# Altium schematic sheet Driver.SchDoc
size 279 x 215 mm; Engineer: Kyle Hong; Revision: 2; SheetNumber: 2; SheetTotal: 3
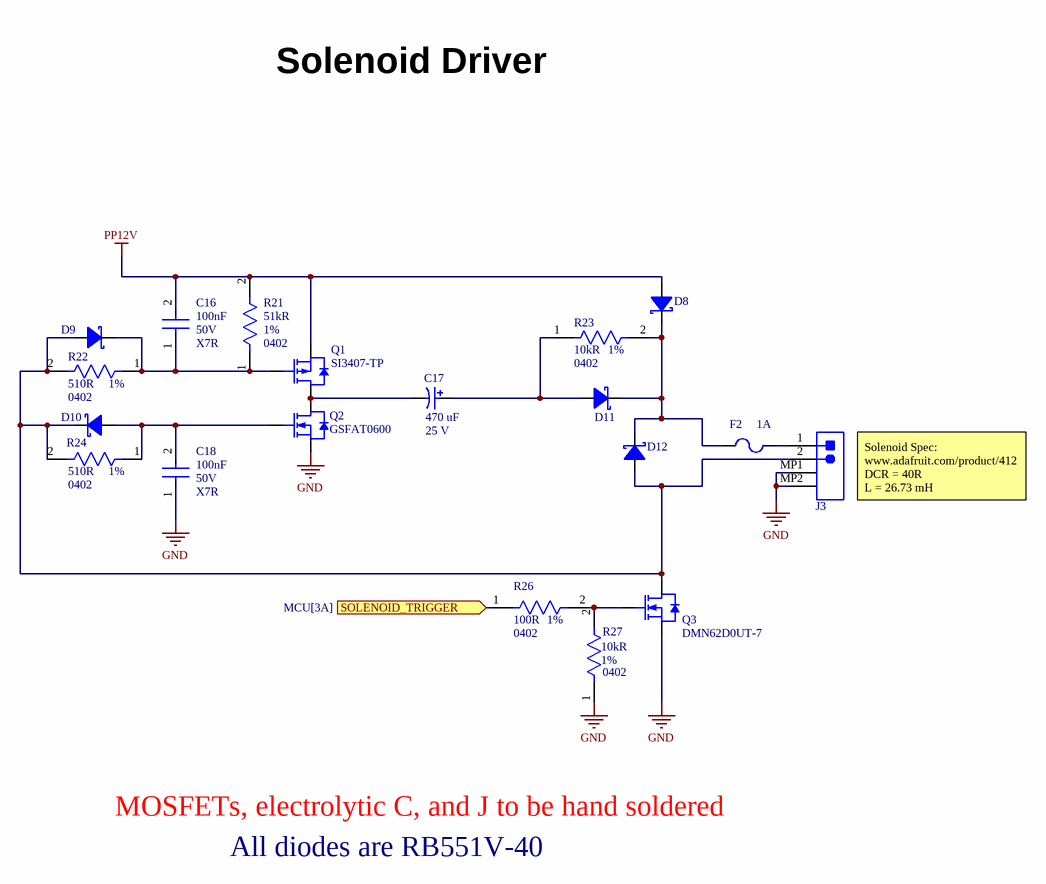
[diagram p0: Driver.SchDoc]

## Parts
C16  Dielectric: X7R  Voltage Rating: 50V  Capacitance: 100nF  [CAP0402]  (hidden comment: CL05B104KB54PNC)
C17  Rated Capacitance: 470 uF  Rated Voltage: 25 V  [NIC-CAPA2-10X10_V]  (hidden comment: UUD1E471MNL1GS)
C18  Dielectric: X7R  Voltage Rating: 50V  Capacitance: 100nF  [CAP0402]  (hidden comment: CL05B104KB54PNC)
D8  RB551V-40  [SOD-323]  (value not drawn)
D9  RB551V-40  [SOD-323]  (value not drawn)
D10  RB551V-40  [SOD-323]  (value not drawn)
D11  RB551V-40  [SOD-323]  (value not drawn)
D12  RB551V-40  [SOD-323]  (value not drawn)
F2  Current Rating: 1A  [FUSE_0603]  (hidden comment: 0467001.NRHF)
J3  S2B-PH-SM4-TB(LF)(SN)  [JST- S2B-PH-SM4-TB(LF)(SN)-2_V]  (value not drawn)
Q1  SI3407-TP  [SOT23-3]
Q2  GSFAT0600  [SOT-523]
Q3  DMN62D0UT-7  [SOT-523]
R21  Tolerance: 1%  Resistance: 51kR  Package: 0402  [RES0402]  (hidden comment: 0402WGF5102TCE)
R22  Tolerance: 1%  Resistance: 510R  Package: 0402  [RES0402]  (hidden comment: 0402WGF5100TCE)
R23  Tolerance: 1%  Resistance: 10kR  Package: 0402  [RES0402]  (hidden comment: 0402WGF1002TCE)
R24  Tolerance: 1%  Resistance: 510R  Package: 0402  [RES0402]  (hidden comment: 0402WGF5100TCE)
R26  Tolerance: 1%  Resistance: 100R  Package: 0402  [RES0402]  (hidden comment: 0402WGF1000TCE)
R27  Tolerance: 1%  Resistance: 10kR  Package: 0402  [RES0402]  (hidden comment: 0402WGF1002TCE)

## Ports
SOLENOID_TRIGGER (in, see MCU[3A])

## Nets
GND: C18.1 J3.MP1 J3.MP2 Q2.2(SOURCE) Q3.2(SOURCE) R27.1
PP12V: C16.2 D8.2(Anode) Q1.2(Source) R21.2
SOLENOID_TRIGGER: R26.1 ; port SOLENOID_TRIGGER
NetC16_1: C16.1 D9.1(Cathode) Q1.1(Gate) R21.1 R22.1
NetC17_1: C17.1 D11.2(Anode) R23.1
NetC17_2: C17.2 Q1.3(Drain) Q2.3(DRAIN)
NetC18_2: C18.2 D10.2(Anode) Q2.1(GATE) R24.1
NetD8_1: D8.1(Cathode) D11.1(Cathode) D12.1(Cathode) F2.1 R23.2
NetD9_2: D9.2(Anode) D10.1(Cathode) D12.2(Anode) J3.2 Q3.3(DRAIN) R22.2 R24.2
NetF2_2: F2.2 J3.1
NetQ3_1: Q3.1(GATE) R26.2 R27.2

## Notes on the sheet
- Solenoid Driver
- (near J3) Solenoid Spec:
  www.adafruit.com/product/412
  DCR = 40R
  L = 26.73 mH
- MOSFETs, electrolytic C, and J to be hand soldered
- All diodes are RB551V-40
- 200 University Ave W
- MTE '24 Group 41
- REV
- PROJECT
- Dynamic Ankle Support
- Waterloo, Ontario, Canada
- N2L 3G1
- DOCUMENT
- ENGINEER
- REVIEWER
- MODIFIED
- SHEET
- OF

## Library data of the parts
C16 C18 = CAP0402: 50V 100nF X7R ±10% 0402  Multilayer Ceramic Capacitors MLCC - SMD/SMT ROHS; Manufacturer: Samsung Electro-Mechanics; Tolerance: ±20%; Manufacturer Part Number: CL05B104KB54PNC; Package: 0402
C17 = CMP-0687-00002-1: Aluminum Electrolytic Capacitor, UD Series, Low Impedance, 470 uF, 25 V, + / - 20%, -55 to 105 degC, Chip Type, 10 x 10 mm D x L, Pb-Free, Reel; Manufacturer: Nichicon; Impedance: 0.09 Ohm; Endurance Time: 5000 h; Rated Ripple Current (at 100kHz): 670 mA; Packing: Dia382mm Reel; Tolerance Rated Capacitance: -20 to 20%; ComponentLink3URL: http://products.nichicon.co.jp/en/pdf/XJA043/e-ud.pdf; ComponentLink2URL: http://products.nichicon.co.jp/en/pdf/XJA043/e-ud.pdf; Length: 10 mm; PartNumber: UUD1E471MNL1GS; ComponentLink3Description: Package Specification; PackageReference: CAPAE-D10H10; ComponentLink1URL: http://www.nichicon.co.jp/; DatasheetVersion: 08/2012; ComponentLink1Description: Manufacturer URL; ComponentLink2Description: Datasheet; Diameter: 10 mm; PackageDescription: 2-Pin Surface Mount Device, Diameter 10 mm, Height 10 mm, Pitch 8 mm; RoHS: TRUE; Mounting Technology: Surface Mount
D8-D12 = RB551V-40: 40V 470mV@500mA 0.5A SOD-323  Schottky Barrier Diodes (SBD) ROHS; Manufacturer: Taiwan Semiconductor; Vf (Max): 470mV @ 0.5A; Manufacturer Part Number: RB551V-40; Mounting Type: SMD; Vr (Max): 40V; Io: 0.5A; Package/Footprint: SOD-323
F2 = FUSE0603: 50A SMD Fuse 1A 32V 32V 0603  Fuses ROHS; Manufacturer: Littelfuse; Manufacturer Part Number: 0467001.NRHF; Package: 0603; Voltage Rating: 32V; Supplier 1: Future Electronics; Supplier Part Number 1: 6130137
J3 = CMP-1755-00001-1: Male Header, Pitch 2 mm, 1 x 2 Position, Height 5.5 mm, -25 to 85 degC, RoHS, Tape and Reel; Current Rating: 3 A; ComponentLink1URL: http://www.jst.com/home2.html; Radiation Hardening: No; RoHSCompliant: True; Mount: Through Hole; Contact Material: Bronze; Package Quantity: 100; Width: 2.34 mm; DatasheetVersion: Dec-12; Height: 8.13 mm; Max Operating Temperature: 105degC; ComponentLink2Description: Datasheet; Lead Pitch: 0.1 inch; Contact Finish: Lead; Packaging: Bulk; Colour: Black; Contact Plating: Tin; Min Operating Temperature: -65degC; ComponentLink1Description: Manufacturer URL; PackageReference: S2B-PH-SM4-TB(LF)(SN)-2; PackageDescription: Male Header, Pitch 2 mm, 1 x 2 Position, Height 5.5 mm; ComponentLink2URL: http://www.jst-mfg.com/product/pdf/eng/ePH.pdf; Pins: 40; Length: 101.19 mm
Q1 = IRLML5103TRPBF: MOSFET P-CH 30V 4.1A SOT23; Manufacturer 1: Micro Commercial Co; Vgs (Max): ±20V; Power Dissipation (Max): 1.3W; Vth (Max): 3V @250uA; Vdss: 30V; Mounting Type: SMD; Manufacturer Part Number 1: SI3407-TP; Supplier 1: Digikey; Supplier Part Number 1: SI3407-TPMSCT-ND
Q2 = DMN62D0UT-7: MOSFET, N-CH, SINGLE, 0.30A, 60V; Vgs(th) (Max) @ Id: 2.5V @ 250uA; Vgs (Max): ±20V; Id @ 25°C: 300mA; Vdss: 60V; Package: SOT-523; Supplier 1: Digikey; Supplier Part Number 1: 4786-GSFAT0600CT-ND
Q3 = DMN62D0UT-7: NFET 60 V 320mA (Ta) 230mW (Ta) Surface Mount SOT-523; Vdss: 60V; Vgs(th) (Max) @ Id: 1V @ 250uA; Vgs (Max): ±20V; Supplier 1: Digikey; Supplier Part Number 1: DMN62D0UT-7DICT-ND; Package: SOT-523; Id @ 25°C: 320mA
R21 = RES0402: 62.5mW Thick Film Resistors ±100ppm/℃ ±1% 51kΩ 0402  Chip Resistor - Surface Mount ROHS; Manufacturer: UNI-ROYAL(Uniroyal Elec); Power Rating: 62.5mW; Manufacturer Part Number: 0402WGF5102TCE
R22 R24 = RES0402: 62.5mW Thick Film Resistors ±100ppm/℃ ±1% 510Ω 0402  Chip Resistor - Surface Mount ROHS; Manufacturer: UNI-ROYAL(Uniroyal Elec); Power Rating: 62.5mW; Manufacturer Part Number: 0402WGF5100TCE
R23 R27 = RES0402: 62.5mW Thick Film Resistors ±100ppm/℃ ±1% 10kΩ 0402  Chip Resistor - Surface Mount ROHS; Manufacturer: UNI-ROYAL(Uniroyal Elec); Power Rating: 62.5mW; Manufacturer Part Number: 0402WGF1002TCE
R26 = RES0402: 62.5mW Thick Film Resistors ±1% ±200ppm/℃ 100Ω 0402  Chip Resistor - Surface Mount ROHS; Manufacturer: UNI-ROYAL(Uniroyal Elec); Power Rating: 62.5mW; Manufacturer Part Number: 0402WGF1000TCE